# EAGLE design gb-001 (EAGLE 9.6.2)
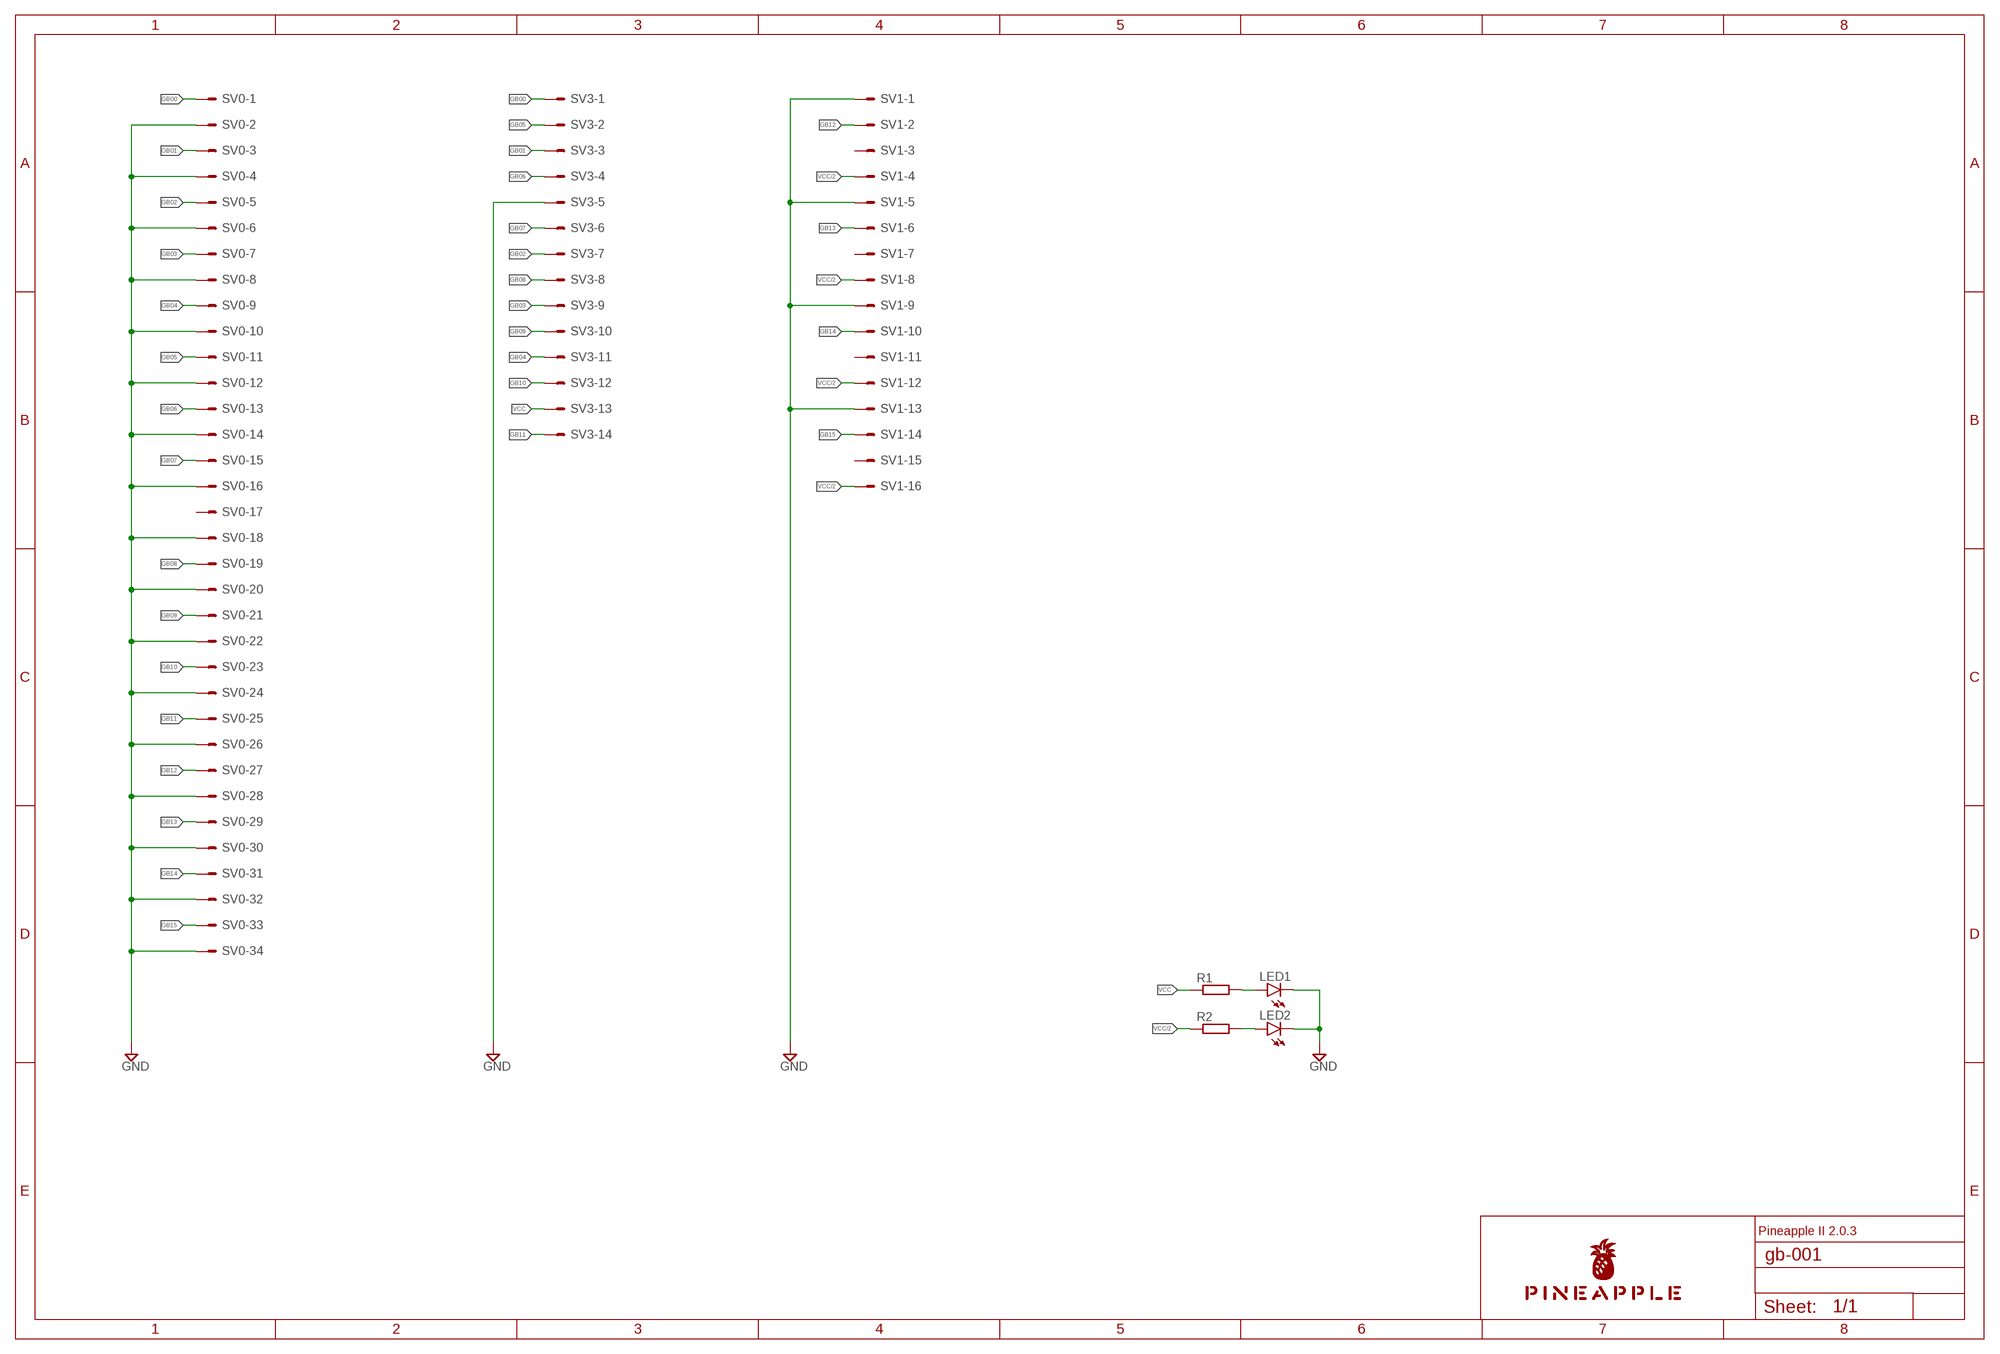
[diagram p0: schematic, sheet 1]

## Parts
LED1  LED3MM  [LED3MM]
LED2  LED3MM  [LED3MM]
R1  R-EU_0204/5  [0204/5]
R2  R-EU_0204/5  [0204/5]
SV0  ML34LE  [ML34L]
SV1  ML16LE  [ML16L]
SV3  ML14LE  [ML14L]
U$1  PINEAPPLE450_SILK  [PINEAPPLE450_SILK]

## Nets
GB00: SV0.1 SV3.1
GB01: SV0.3 SV3.3
GB02: SV0.5 SV3.7
GB03: SV0.7 SV3.9
GB04: SV0.9 SV3.11
GB05: SV0.11 SV3.2
GB06: SV0.13 SV3.4
GB07: SV0.15 SV3.6
GB08: SV0.19 SV3.8
GB09: SV0.21 SV3.10
GB10: SV0.23 SV3.12
GB11: SV0.25 SV3.14
GB12: SV0.27 SV1.2
GB13: SV0.29 SV1.6
GB14: SV0.31 SV1.10
GB15: SV0.33 SV1.14
GND: LED1.K(C) LED2.K(C) SV0.2 SV0.4 SV0.6 SV0.8 SV0.10 SV0.12 SV0.14 SV0.16 SV0.18 SV0.20 SV0.22 SV0.24 SV0.26 SV0.28 SV0.30 SV0.32 SV0.34 SV1.1 SV1.5 SV1.9 SV1.13 SV3.5
VCC: R1.1 SV3.13
VCC2LED: LED2.A R2.2
VCC/2: R2.1 SV1.4 SV1.8 SV1.12 SV1.16
VCCLED: LED1.A R1.2
Unconnected: SV0.17 SV1.3 SV1.7 SV1.11 SV1.15

## Notes on the sheet
- Pineapple II 2.0.3

## Library data of the parts
LED1 LED2 = led:LED: LED OSRAM: - CHIPLED LG R971, LG N971, LY N971, LG Q971, LY Q971, LO R971, LY R971 LH N974, LH R974 LS Q976, LO Q976, LY Q976 LO Q996 - Hyper CHIPLED LW Q18S LB Q993, LB Q99A, LB R99A - SideLED LS A670, LO A670, LY A670, LG A670, LP A670 LB A673, LV A673, LT A673, LW A673 LH A674 LY A675 LS A676, LA A676, LO A676, LY A676, LW A676 LS A679, LY A679, LG A679 - Hyper Micro SIDELED® LS Y876, LA Y876, LO Y876, LY Y876 LT Y87S - SmartLED LW L88C, LW L88S LB L89C, LB L89S, LG L890 LS L89K, LO L89K, LY L89K LS L896, LA L896, LO L896, LY L896 - TOPLED LS T670, LO T670, LY T670, LG T670, LP T670 LSG T670, LSP T670, LSY T670, LOP T670, LYG T670 LG T671, LOG T671, LSG T671 LB T673, LV T673, LT T673, LW T673 LH T674 LS T676, LA T676, LO T676, LY T676, LB T676, LH T676, LSB T676, LW T676 LB T67C, LV T67C, LT T67C, LS T67K, LO T67K, LY T67K, LW E67C LS E67B, LA E67B, LO E67B, LY E67B, LB E67C, LV E67C, LT E67C LW T67C LS T679, LY T679, LG T679 LS T770, LO T770, LY T770, LG T770, LP T770 LB T773, LV T773, LT T773, LW T773 LH T774 LS E675, LA E675, LY E675, LS T675 LS T776, LA T776, LO T776, LY T776, LB T776 LHGB T686 LT T68C, LB T68C - Hyper Mini TOPLED® LB M676 - Mini TOPLED Santana® LG M470 LS M47K, LO M47K, LY M47K Source: http://www.osram.convergy.de LUXEON: - LUMILED® LXK2-PW12-R00, LXK2-PW12-S00, LXK2-PW14-U00, LXK2-PW14-V00 LXK2-PM12-R00, LXK2-PM12-S00, LXK2-PM14-U00 LXK2-PE12-Q00, LXK2-PE12-R00, LXK2-PE12-S00, LXK2-PE14-T00, LXK2-PE14-U00 LXK2-PB12-K00, LXK2-PB12-L00, LXK2-PB12-M00, LXK2-PB14-N00, LXK2-PB14-P00, LXK2-PB14-Q00 LXK2-PR12-L00, LXK2-PR12-M00, LXK2-PR14-Q00, LXK2-PR14-R00 LXK2-PD12-Q00, LXK2-PD12-R00, LXK2-PD12-S00 LXK2-PH12-R00, LXK2-PH12-S00 LXK2-PL12-P00, LXK2-PL12-Q00, LXK2-PL12-R00 Source: www.luxeon.com KINGBRIGHT: KA-3528ASYC Source: www.kingbright.com
R1 R2 = rcl:R-EU_: RESISTOR, European symbol; SPICEPREFIX: R
SV0 = con-ml:ML34LE: HARTING; OC_FARNELL: unknown; OC_NEWARK: unknown
SV1 = con-ml:ML16LE: HARTING; OC_FARNELL: unknown; OC_NEWARK: unknown
SV3 = con-ml:ML14LE: HARTING; OC_FARNELL: unknown; OC_NEWARK: unknown
U$1 = pineapple:PINEAPPLE450_SILK

## Net classes
0 default: width 0.152 mm, drill 0.152 mm, clearance 0.152 mm
1 gnd: width 0.305 mm, drill 0.152 mm, clearance 0.152 mm
2 power: width 0.508 mm, drill 0.152 mm, clearance 0.152 mm
3 analog: width 0.305 mm, drill 0.152 mm, clearance 0.152 mm
4 superpower: width 1.016 mm, drill 0.152 mm, clearance 0.152 mm

## Board
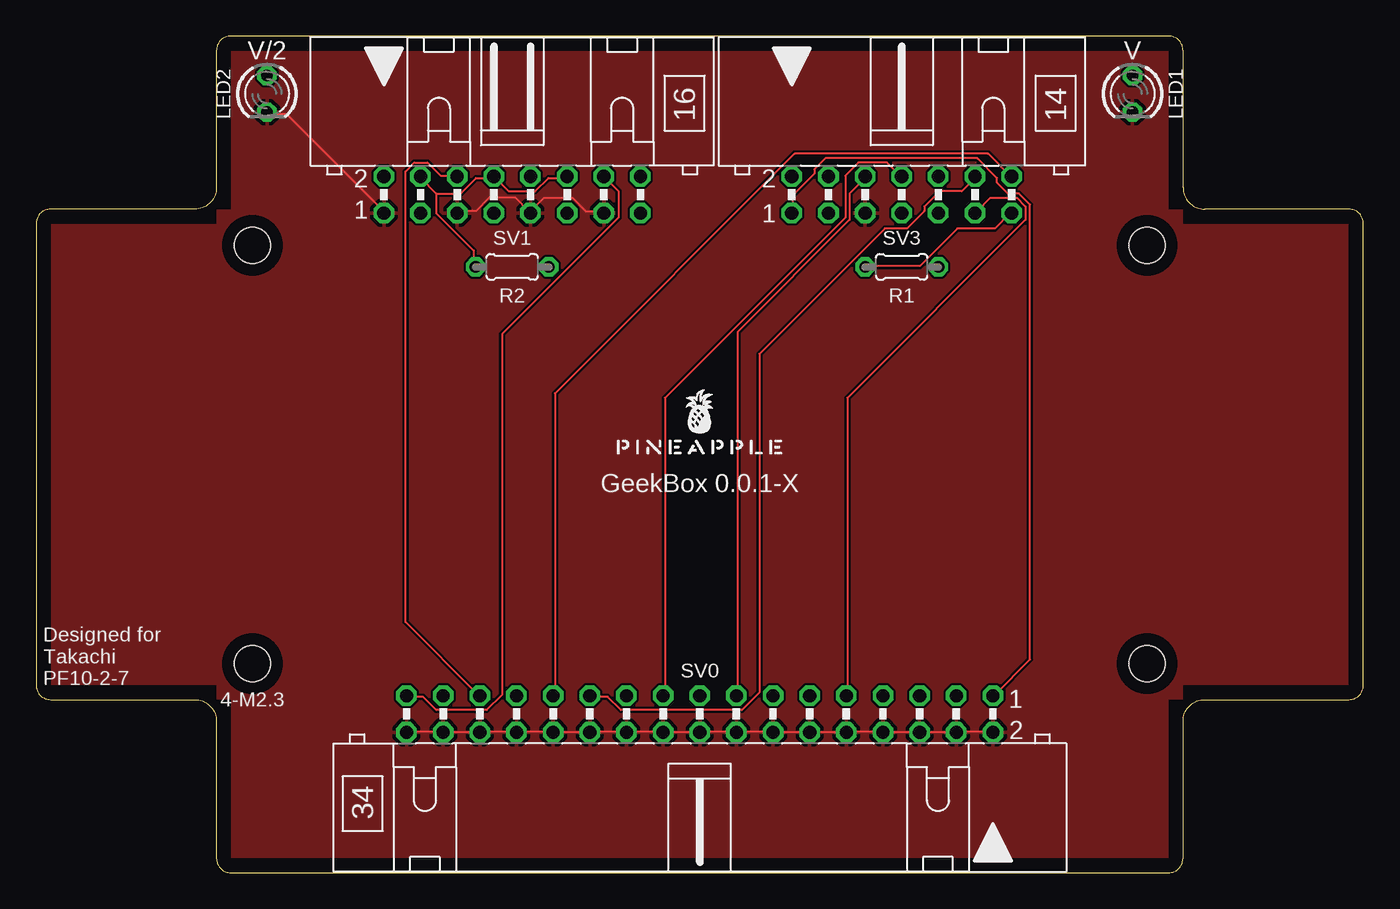
[diagram p1: board, top side]
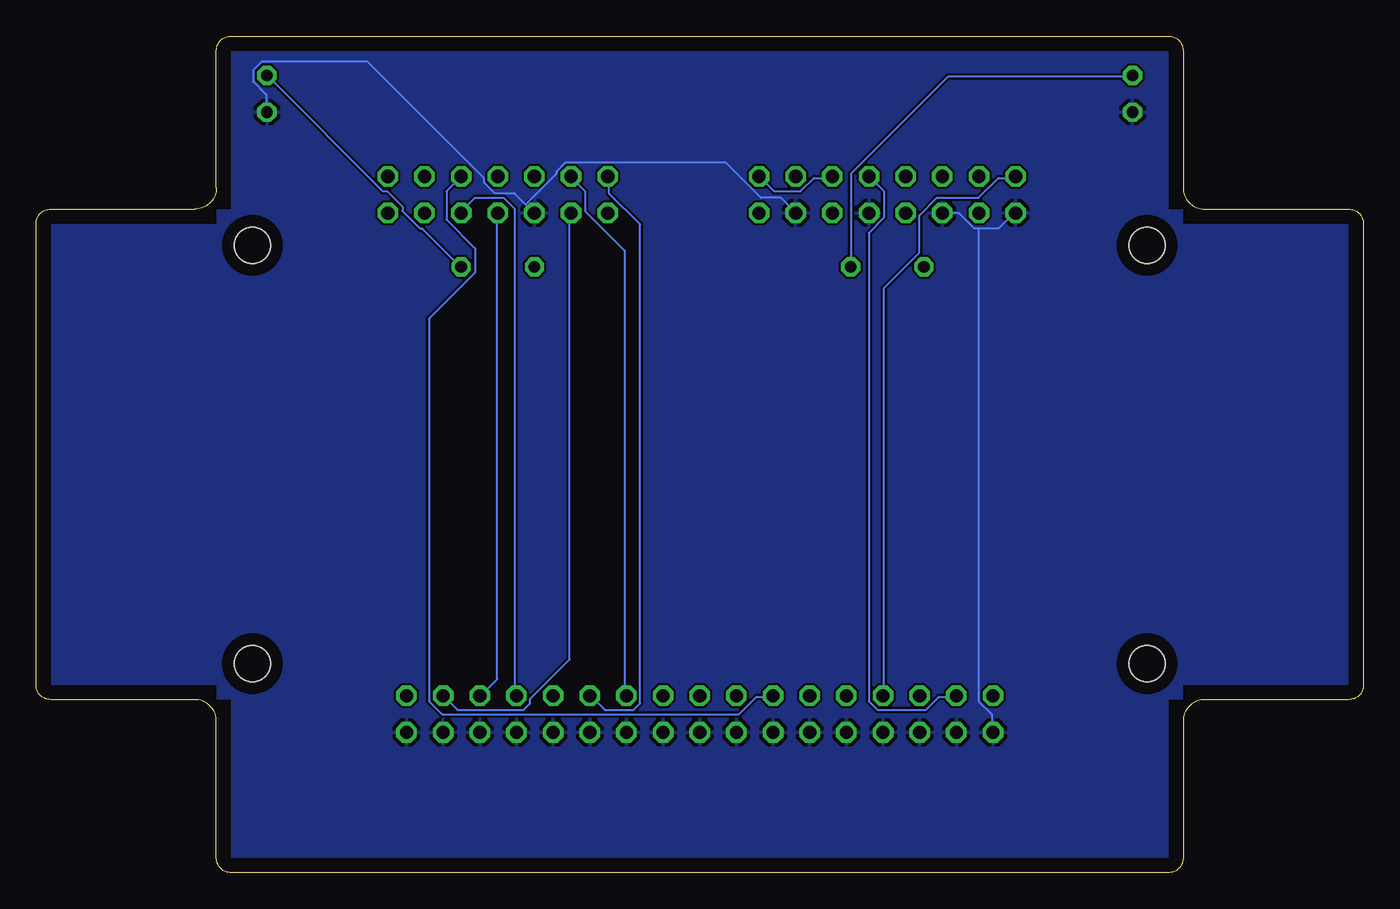
[diagram p2: board, bottom side, seen from below]

Size 92 x 58 mm. Coordinates in mm from the lower left corner, seen from the top.
Outline: 78.5,58 13.5,58 arc90 12.5,57 12.5,47.5 arc-90 11,46 1,46 arc90 0,45 0,13 arc90 1,12 11,12 arc-90 12.5,10.5 12.5,1 arc90 13.5,0 78.5,0 arc90 79.5,1 79.5,10.5 arc-90 81,12 91,12 arc90 92,13 92,45 arc90 91,46 81,46 arc-90 79.5,47.5 79.5,57 arc90 78.5,58
Copper layers (1*16): Top 0.035mm / dielectric 1.5mm / Bottom 0.035mm
Design rules "SeeedStudio_2layer_DRU_no_angle_20140221": minimum track width 6mil, minimum drill 12mil, track to track 6mil, track to pad 6mil, pad to pad 6mil, via to via 6mil, smd to smd 0mil, copper to edge 10mil, drill to drill 10mil, minimum pad ring 10mil, minimum via ring 6mil, stop-mask expansion 2mil, vias tented up to drill 100mil, thermal gap 10mil
Holes 2.5 mm at 77,43.5 15,43.5 15,14.5 77,14.5
tRestrict: area 13,41.5 to 17,45.5; area 75,41.5 to 79,45.5; area 13,12.5 to 17,16.5; area 75,12.5 to 79,16.5; area 0,57 to 92,58; area 91,0 to 92,58; area 0,0 to 92,1; area 0,0 to 1,58; area 0,45 to 12.5,46; area 12.5,46 to 13.5,58; area 78.5,46 to 79.5,58; area 79.5,45 to 92,46; 4 more areas
bRestrict: area 13,12.5 to 17,16.5; area 75,12.5 to 79,16.5; area 75,41.5 to 79,45.5; area 13,41.5 to 17,45.5; area 78.5,0 to 79.5,12; area 79.5,12 to 92,13; area 91,0 to 92,58; area 79.5,45 to 92,46; area 78.5,46 to 79.5,58; area 0,57 to 92,58; area 12.5,46 to 13.5,58; area 0,45 to 12.5,46; 4 more areas

### Footprints (pad centres in the part's own frame; a part is rotated, then mirrored left to right if it is on the bottom)
LED3MM = drill 0.813 octagon: A -1.27,0; K 1.27,0
0204/5 = drill 0.813 octagon: 1 -2.54,0; 2 2.54,0
ML34L = drill 0.914 octagon: 1 -20.32,-1.27; 2 -20.32,1.27; 3 -17.78,-1.27; 4 -17.78,1.27; 5 -15.24,-1.27; 6 -15.24,1.27; 7 -12.7,-1.27; 8 -12.7,1.27; 9 -10.16,-1.27; 10 -10.16,1.27; 11 -7.62,-1.27; 12 -7.62,1.27; 13 -5.08,-1.27; 14 -5.08,1.27; 15 -2.54,-1.27; 16 -2.54,1.27; 17 0,-1.27; 18 0,1.27; 19 2.54,-1.27; 20 2.54,1.27; 21 5.08,-1.27; 22 5.08,1.27; 23 7.62,-1.27; 24 7.62,1.27; 25 10.16,-1.27; 26 10.16,1.27; 27 12.7,-1.27; 28 12.7,1.27; 29 15.24,-1.27; 30 15.24,1.27; 31 17.78,-1.27; 32 17.78,1.27; 33 20.32,-1.27; 34 20.32,1.27
ML16L = drill 0.914 octagon: 1 -8.89,-1.27; 2 -8.89,1.27; 3 -6.35,-1.27; 4 -6.35,1.27; 5 -3.81,-1.27; 6 -3.81,1.27; 7 -1.27,-1.27; 8 -1.27,1.27; 9 1.27,-1.27; 10 1.27,1.27; 11 3.81,-1.27; 12 3.81,1.27; 13 6.35,-1.27; 14 6.35,1.27; 15 8.89,-1.27; 16 8.89,1.27
ML14L = drill 0.914 octagon: 1 -7.62,-1.27; 2 -7.62,1.27; 3 -5.08,-1.27; 4 -5.08,1.27; 5 -2.54,-1.27; 6 -2.54,1.27; 7 0,-1.27; 8 0,1.27; 9 2.54,-1.27; 10 2.54,1.27; 11 5.08,-1.27; 12 5.08,1.27; 13 7.62,-1.27; 14 7.62,1.27

### Placement (x,y rotation side)
LED1  76,54 270 top
LED2  16,54 270 top
R1  60,42 0 top
R2  33,42 0 top
SV0  46,11 180 top
SV1  33,47 0 top
SV3  60,47 0 top
U$1  46,29 0 top

### Tracks (layer width: path | path; a pad name or v marks a point on that pad's centre or on a via)
GB00
  Top 0.152: SV3.1 52.43,45.87 52.43,46.94 53.95,48.46 53.95,48.77 54.71,49.53 65.23,49.53 66.6,48.16 66.6,47.85 67.36,47.09 68.12,47.09 68.89,46.33 68.89,14.78 66.45,12.34 SV0.1
GB01
  Bottom 0.152: SV3.3 55.02,45.72 55.02,14.78 57.76,12.04 57.76,11.73 58.22,11.28 62.79,11.28 63.7,12.19 SV0.3
GB02
  Bottom 0.152: SV3.7 60.05,45.72 60.05,13.41 61.11,12.34 SV0.5
GB03
  Bottom 0.152: SV0.7 58.83,12.34 58.83,46.02 59.59,46.79 61.57,46.79 62.48,45.87 SV3.9
GB04
  Top 0.152: SV0.9 56.24,12.34 56.24,32.92 68.58,45.26 68.58,46.18 67.97,46.79 66.14,46.79 65.23,45.87 SV3.11
GB05
  Bottom 0.152: SV3.2 52.27,48.16 52.27,47.09 50.14,44.96 50.14,11.73 50.6,11.28 52.58,11.28 53.49,12.19 SV0.11
GB06
  Bottom 0.152: SV0.13 51.21,12.34 51.21,43.13 53.95,45.87 53.95,47.24 54.86,48.16 SV3.4
GB07
  Top 0.152: SV0.15 48.62,12.34 48.62,37.49 56.39,45.26 56.39,47.09 57.45,48.16 SV3.6
GB08
  Top 0.152: SV0.19 43.59,12.34 43.59,32.92 56.08,45.41 56.08,48.31 57,49.23 58.98,49.23 59.89,48.31 SV3.8
GB09
  Bottom 0.152: SV0.21 41,12.19 42.06,12.19 43.28,10.97 63.86,10.97 64.77,11.89 64.77,38.41 61.57,41.6 61.57,43.28 63.55,45.26 63.55,47.24 62.64,48.16 SV3.10
GB10
  Top 0.152: SV0.23 38.41,12.19 39.62,12.19 40.54,11.28 48.92,11.28 50.14,12.5 50.14,35.97 58.83,44.65 60.35,44.65 61.57,45.87 61.57,46.18 62.64,47.24 64.16,47.24 65.08,48.16 SV3.12
GB11
  Top 0.152: SV0.25 35.97,12.34 35.97,33.22 52.58,49.84 65.99,49.84 67.51,48.31 SV3.14
GB12
  Bottom 0.152: SV1.2 24.23,48.16 25.3,48.16 26.67,46.79 29.57,46.79 30.79,45.57 30.79,42.98 33.22,40.54 33.22,12.34 SV0.27
GB13
  Top 0.152: SV1.6 29.11,48.31 28.04,48.31 27.13,49.23 26.21,49.23 25.6,48.62 25.6,17.37 30.63,12.34 SV0.29
GB14
  Bottom 0.152: SV0.31 28.35,12.19 29.41,12.19 30.33,11.28 33.68,11.28 34.29,11.89 34.29,44.35 33.22,45.41 33.22,47.24 34.14,48.16 SV1.10
GB15
  Top 0.152: SV0.33 25.76,12.19 26.82,12.19 27.74,11.28 31.24,11.28 32.31,12.34 32.31,37.34 40.39,45.41 40.39,47.24 39.47,48.16 SV1.14
GND
  Top 0.152: SV0.34 25.76,9.75 28.19,9.75 SV0.32 28.35,9.75 30.63,9.75 SV0.30 30.79,9.75 33.22,9.75 SV0.28 33.38,9.75 35.81,9.75 SV0.26 35.97,9.75 38.25,9.75 SV0.24 38.41,9.75 40.84,9.75 SV0.22 41,9.75 43.43,9.75 SV0.20 43.59,9.75 45.87,9.75 SV0.18 46.02,9.75 48.46,9.75 SV0.16 48.62,9.75 51.05,9.75 SV0.14 51.21,9.75 53.49,9.75 SV0.12 53.65,9.75 56.08,9.75 SV0.10 56.24,9.75 58.67,9.75 SV0.8 58.83,9.75 61.11,9.75 SV0.6 61.27,9.75 63.7,9.75 SV0.4 63.86,9.75 66.29,9.75 SV0.2 | SV1.5 29.26,45.87 30.48,45.87 31.39,46.79 33.22,46.79 34.14,45.87 SV1.9 34.29,45.87 35.2,46.79 37.19,46.79 38.1,45.87 39.32,45.87 SV1.13 | LED2.K 16,52.58 17.37,52.58 24.08,45.87 SV1.1
  Bottom 0.152: 58.06,46.33 57.61,45.87 SV3.5 | 58.06,46.33 58.83,47.09 60.2,47.09 60.96,47.85 60.96,48.16 69.04,56.24 76.35,56.24 76.96,55.63 76.96,54.86 76.05,53.95 76.05,52.73 LED1.K | 26.67,44.65 25.3,44.65 24.23,45.72 SV1.1 | 26.67,44.65 26.98,44.65 28.04,45.72 29.11,45.72 SV1.5 | 58.06,46.33 55.93,48.46 55.93,48.62 55.32,49.23 44.2,49.23 41.76,46.79 40.39,46.79 39.47,45.87 SV1.13 | 26.67,44.65 26.67,11.89 25.76,10.97 25.76,9.75 SV0.34
  pour Top: -0.5,-0.5 92.5,-0.5 92.5,58.5 -0.5,58.5
  pour Bottom: -1,-1 93,-1 93,59 -1,59
VCC
  Top 0.152: R1.1 57.61,42.06 61.27,42.06 63.86,44.65 66.45,44.65 67.51,45.72 SV3.13
VCC2LED
  Bottom 0.152: R2.2 35.51,42.06 35.51,48.46 28.8,55.17 16,55.17 LED2.A
VCC/2
  Top 0.152: 27.74,47.09 27.74,45.72 30.33,43.13 30.33,42.06 R2.1 | 27.74,47.09 26.67,48.16 SV1.4 | 27.74,47.09 29.41,47.09 30.48,48.16 31.7,48.16 SV1.8 31.85,48.16 32.77,47.24 34.59,47.24 35.51,48.16 36.73,48.16 SV1.12
  Bottom 0.152: SV1.12 36.88,48.16 38.1,48.16 39.01,47.24 40.84,47.24 41.76,48.16 SV1.16
VCCLED
  Bottom 0.152: R1.2 62.64,42.06 65.23,44.65 65.38,44.65 66.6,45.87 66.6,46.18 67.67,47.24 67.97,47.24 75.89,55.17 LED1.A

### Text on the board
tNames: V/2 | V | GeekBox 0.0.1-X | Designed for / Takachi / PF10-2-7 | 4-M2.3